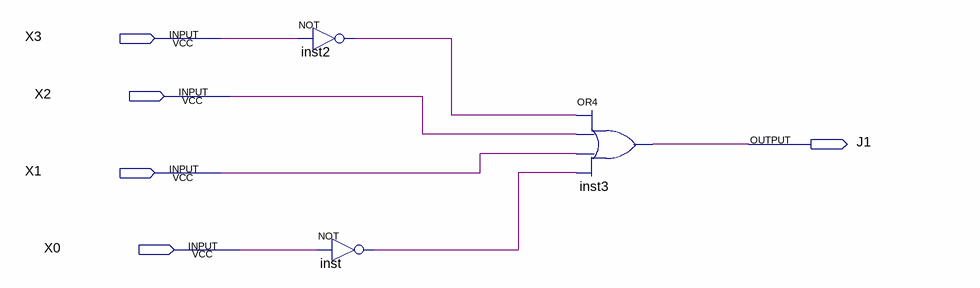
[diagram p0: schematic sheet]
// Quartus schematic J1.bdf as structural Verilog: 3 symbols, 5 pins
module J1 (
  input  X3,
  input  X2,
  input  X1,
  input  X0,
  output J1
);

  wire inst2_out, inst_out;

  not inst2 (inst2_out, X3);
  not inst (inst_out, X0);
  or inst3 (J1, inst2_out, X2, X1, inst_out);
endmodule
